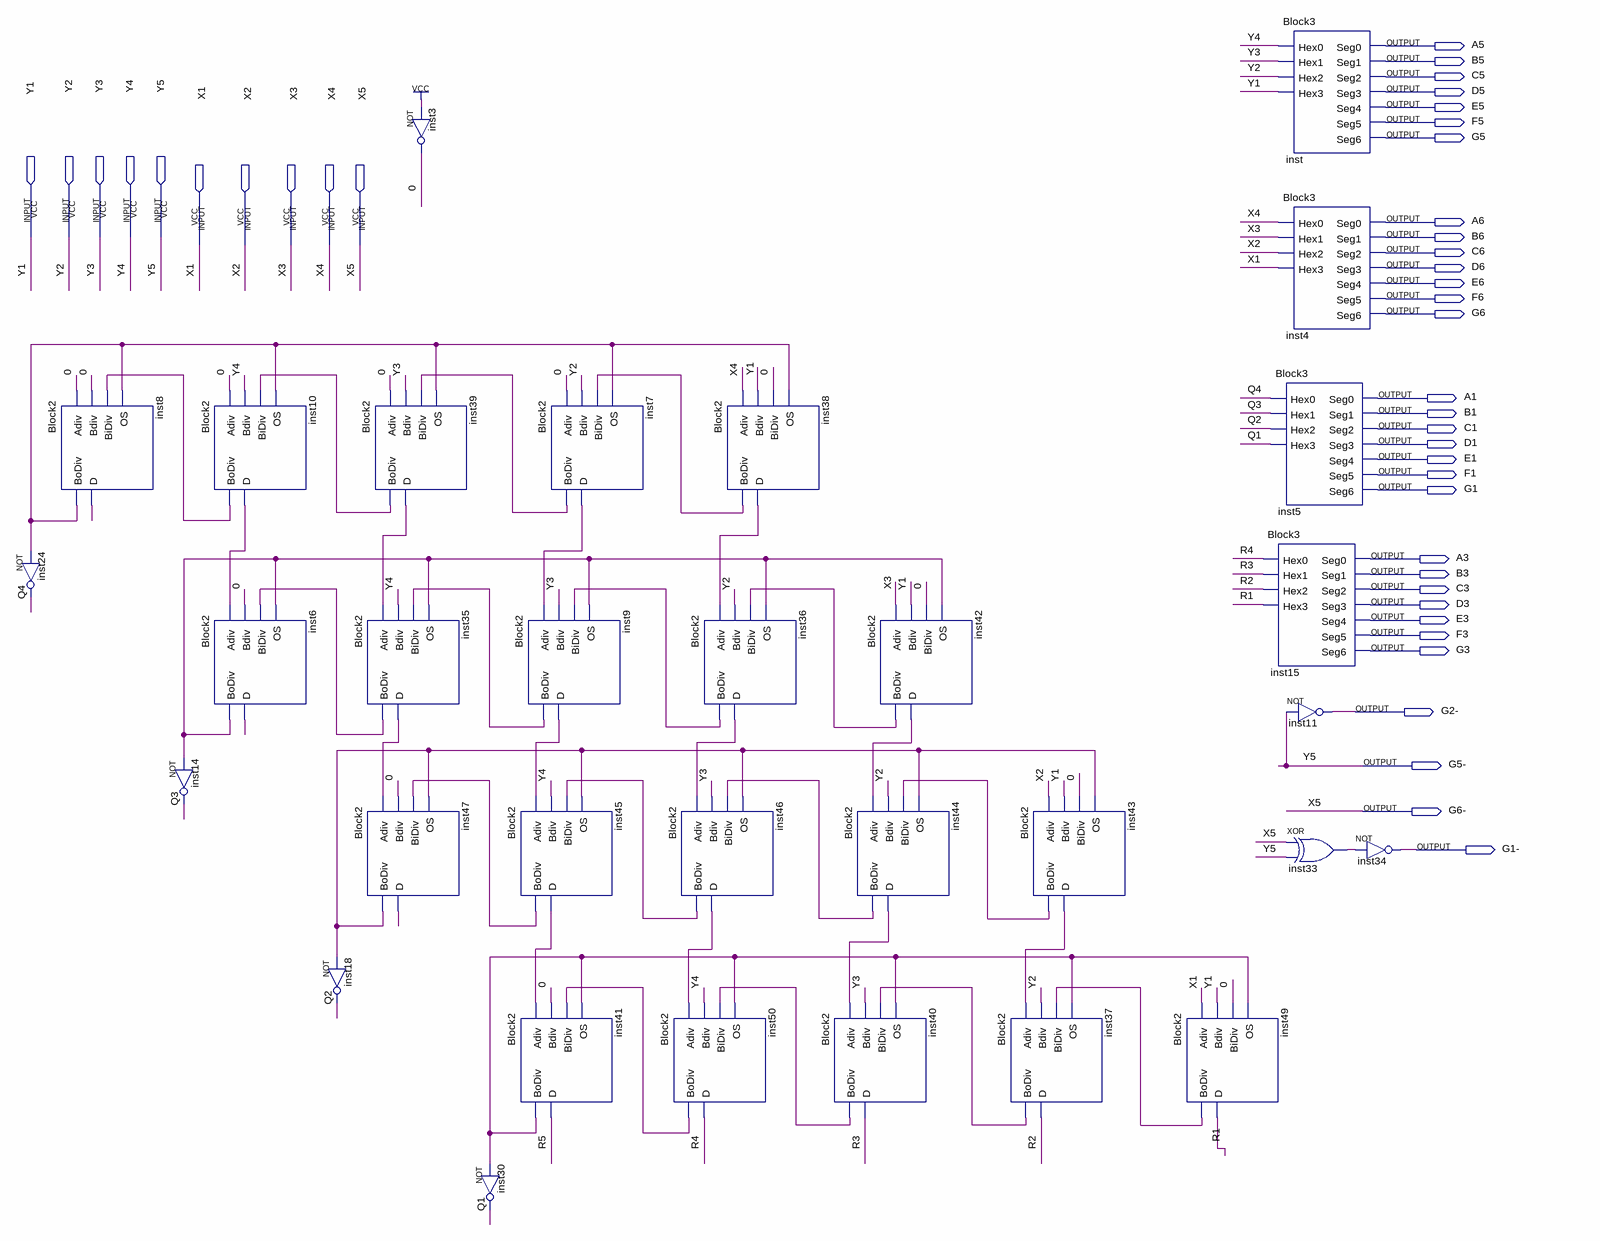
[diagram p0: schematic sheet]
// Quartus schematic aula11.bdf as structural Verilog: 32 symbols, 42 pins
module aula11 (
  input  Y1,
  input  Y2,
  input  Y3,
  input  Y4,
  input  Y5,
  input  X1,
  input  X2,
  input  X3,
  input  X4,
  input  X5,
  output A5,
  output B5,
  output C5,
  output D5,
  output E5,
  output F5,
  output G5,
  output A6,
  output B6,
  output C6,
  output D6,
  output E6,
  output F6,
  output G6,
  output A1,
  output B1,
  output C1,
  output D1,
  output E1,
  output F1,
  output G1,
  output A3,
  output B3,
  output C3,
  output D3,
  output E3,
  output F3,
  output G3,
  output \G2- ,
  output \G5- ,
  output \G6- ,
  output \G1- 
);

  wire \0 , inst6_bodiv, inst6_d, inst7_bodiv, inst7_d, inst8_bodiv, inst8_d, inst9_bodiv, inst9_d,
       inst10_bodiv, inst10_d, inst33_out, inst35_bodiv, inst35_d, inst36_bodiv, inst36_d, inst37_bodiv,
       inst38_bodiv, inst38_d, inst39_bodiv, inst39_d, inst40_bodiv, inst41_bodiv, inst42_bodiv, inst42_d,
       inst43_bodiv, inst43_d, inst44_bodiv, inst44_d, inst45_bodiv, inst45_d, inst46_bodiv, inst46_d,
       inst47_bodiv, inst47_d, inst49_bodiv, inst50_bodiv, Q1, Q2, Q3, Q4, R1, R2, R3, R4, R5;

  not inst24 (Q4, inst8_bodiv);
  Block2 inst8 (.Adiv(\0 ), .Bdiv(\0 ), .BiDiv(inst10_bodiv), .OS(inst8_bodiv), .BoDiv(inst8_bodiv), .D(inst8_d));
  Block2 inst10 (.Adiv(\0 ), .Bdiv(Y4), .BiDiv(inst39_bodiv), .OS(inst8_bodiv), .BoDiv(inst10_bodiv), .D(inst10_d));
  Block2 inst6 (.Adiv(inst10_d), .Bdiv(\0 ), .BiDiv(inst35_bodiv), .OS(inst6_bodiv), .BoDiv(inst6_bodiv), .D(inst6_d));
  not inst14 (Q3, inst6_bodiv);
  not inst18 (Q2, inst47_bodiv);
  not inst3 (\0 , 1'b1);
  Block2 inst39 (.Adiv(\0 ), .Bdiv(Y3), .BiDiv(inst7_bodiv), .OS(inst8_bodiv), .BoDiv(inst39_bodiv), .D(inst39_d));
  Block2 inst35 (.Adiv(inst39_d), .Bdiv(Y4), .BiDiv(inst9_bodiv), .OS(inst6_bodiv), .BoDiv(inst35_bodiv), .D(inst35_d));
  Block2 inst47 (
    .Adiv(inst35_d), .Bdiv(\0 ), .BiDiv(inst45_bodiv), .OS(inst47_bodiv), .BoDiv(inst47_bodiv), .D(inst47_d));
  Block2 inst9 (.Adiv(inst7_d), .Bdiv(Y3), .BiDiv(inst36_bodiv), .OS(inst6_bodiv), .BoDiv(inst9_bodiv), .D(inst9_d));
  Block2 inst45 (
    .Adiv(inst9_d), .Bdiv(Y4), .BiDiv(inst46_bodiv), .OS(inst47_bodiv), .BoDiv(inst45_bodiv), .D(inst45_d));
  Block2 inst41 (.Adiv(inst45_d), .Bdiv(\0 ), .BiDiv(inst50_bodiv), .OS(inst41_bodiv), .BoDiv(inst41_bodiv), .D(R5));
  not inst30 (Q1, inst41_bodiv);
  Block2 inst7 (.Adiv(\0 ), .Bdiv(Y2), .BiDiv(inst38_bodiv), .OS(inst8_bodiv), .BoDiv(inst7_bodiv), .D(inst7_d));
  Block2 inst38 (.Adiv(X4), .Bdiv(Y1), .BiDiv(\0 ), .OS(inst8_bodiv), .BoDiv(inst38_bodiv), .D(inst38_d));
  Block2 inst36 (
    .Adiv(inst38_d), .Bdiv(Y2), .BiDiv(inst42_bodiv), .OS(inst6_bodiv), .BoDiv(inst36_bodiv), .D(inst36_d));
  Block2 inst46 (
    .Adiv(inst36_d), .Bdiv(Y3), .BiDiv(inst44_bodiv), .OS(inst47_bodiv), .BoDiv(inst46_bodiv), .D(inst46_d));
  Block2 inst50 (.Adiv(inst46_d), .Bdiv(Y4), .BiDiv(inst40_bodiv), .OS(inst41_bodiv), .BoDiv(inst50_bodiv), .D(R4));
  Block2 inst40 (.Adiv(inst44_d), .Bdiv(Y3), .BiDiv(inst37_bodiv), .OS(inst41_bodiv), .BoDiv(inst40_bodiv), .D(R3));
  Block2 inst42 (.Adiv(X3), .Bdiv(Y1), .BiDiv(\0 ), .OS(inst6_bodiv), .BoDiv(inst42_bodiv), .D(inst42_d));
  Block2 inst44 (
    .Adiv(inst42_d), .Bdiv(Y2), .BiDiv(inst43_bodiv), .OS(inst47_bodiv), .BoDiv(inst44_bodiv), .D(inst44_d));
  Block2 inst43 (.Adiv(X2), .Bdiv(Y1), .BiDiv(\0 ), .OS(inst47_bodiv), .BoDiv(inst43_bodiv), .D(inst43_d));
  Block2 inst37 (.Adiv(inst43_d), .Bdiv(Y2), .BiDiv(inst49_bodiv), .OS(inst41_bodiv), .BoDiv(inst37_bodiv), .D(R2));
  Block2 inst49 (.Adiv(X1), .Bdiv(Y1), .BiDiv(\0 ), .OS(inst41_bodiv), .BoDiv(inst49_bodiv), .D(R1));
  Block3 inst15 (
    .Hex0(R4), .Hex1(R3), .Hex2(R2), .Hex3(R1), .Seg0(A3), .Seg1(B3), .Seg2(C3), .Seg3(D3), .Seg4(E3),
    .Seg5(F3), .Seg6(G3));
  Block3 inst (
    .Hex0(Y4), .Hex1(Y3), .Hex2(Y2), .Hex3(Y1), .Seg0(A5), .Seg1(B5), .Seg2(C5), .Seg3(D5), .Seg4(E5),
    .Seg5(F5), .Seg6(G5));
  Block3 inst4 (
    .Hex0(X4), .Hex1(X3), .Hex2(X2), .Hex3(X1), .Seg0(A6), .Seg1(B6), .Seg2(C6), .Seg3(D6), .Seg4(E6),
    .Seg5(F6), .Seg6(G6));
  Block3 inst5 (
    .Hex0(Q4), .Hex1(Q3), .Hex2(Q2), .Hex3(Q1), .Seg0(A1), .Seg1(B1), .Seg2(C1), .Seg3(D1), .Seg4(E1),
    .Seg5(F1), .Seg6(G1));
  not inst11 (\G2- , Y5);
  xor inst33 (inst33_out, X5, Y5);
  not inst34 (\G1- , inst33_out);

  assign \G5-  = Y5;
  assign \G6-  = X5;
endmodule
